# Altium schematic sheet Ports.SchDoc
size A4; SheetNumber: 5; SheetTotal: 5
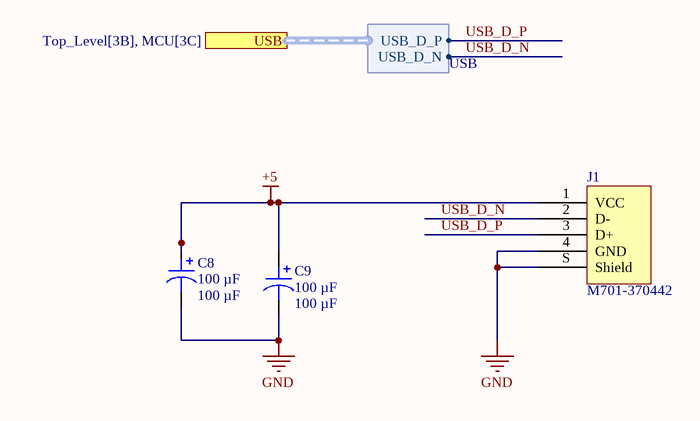
[diagram p0: Ports.SchDoc]

## Parts
C8  100 µF  [CAP POL 2917_7343]
C9  100 µF  [CAP POL 2917_7343]
J1  M701-370442  [HARWIN USB M701-370442]

## Ports
USB (harness USB, see Top_Level[3B], MCU[3C])

## Harnesses
USB: USB_D_N, USB_D_P

## Nets
+5: C8.1 C9.1 J1.1(VCC)
GND: C8.2 C9.2 J1.4(GND) J1.S(Shield)
USB_D_N: J1.2(D-) ; port USB.USB_D_N
USB_D_P: J1.3(D+) ; port USB.USB_D_P

## Library data of the parts
C8 C9 = T491X107K020AT: CAP TANT 100UF 10% 20V 2917; Part Number: T491X107K020AT; Value: 100 µF
J1 = M701-370442: CONN RCPT USB2.0 TYPEB 4P SMD RA; Part Number: M701-370442